# EAGLE design RTCRpi (EAGLE 7.3.0)
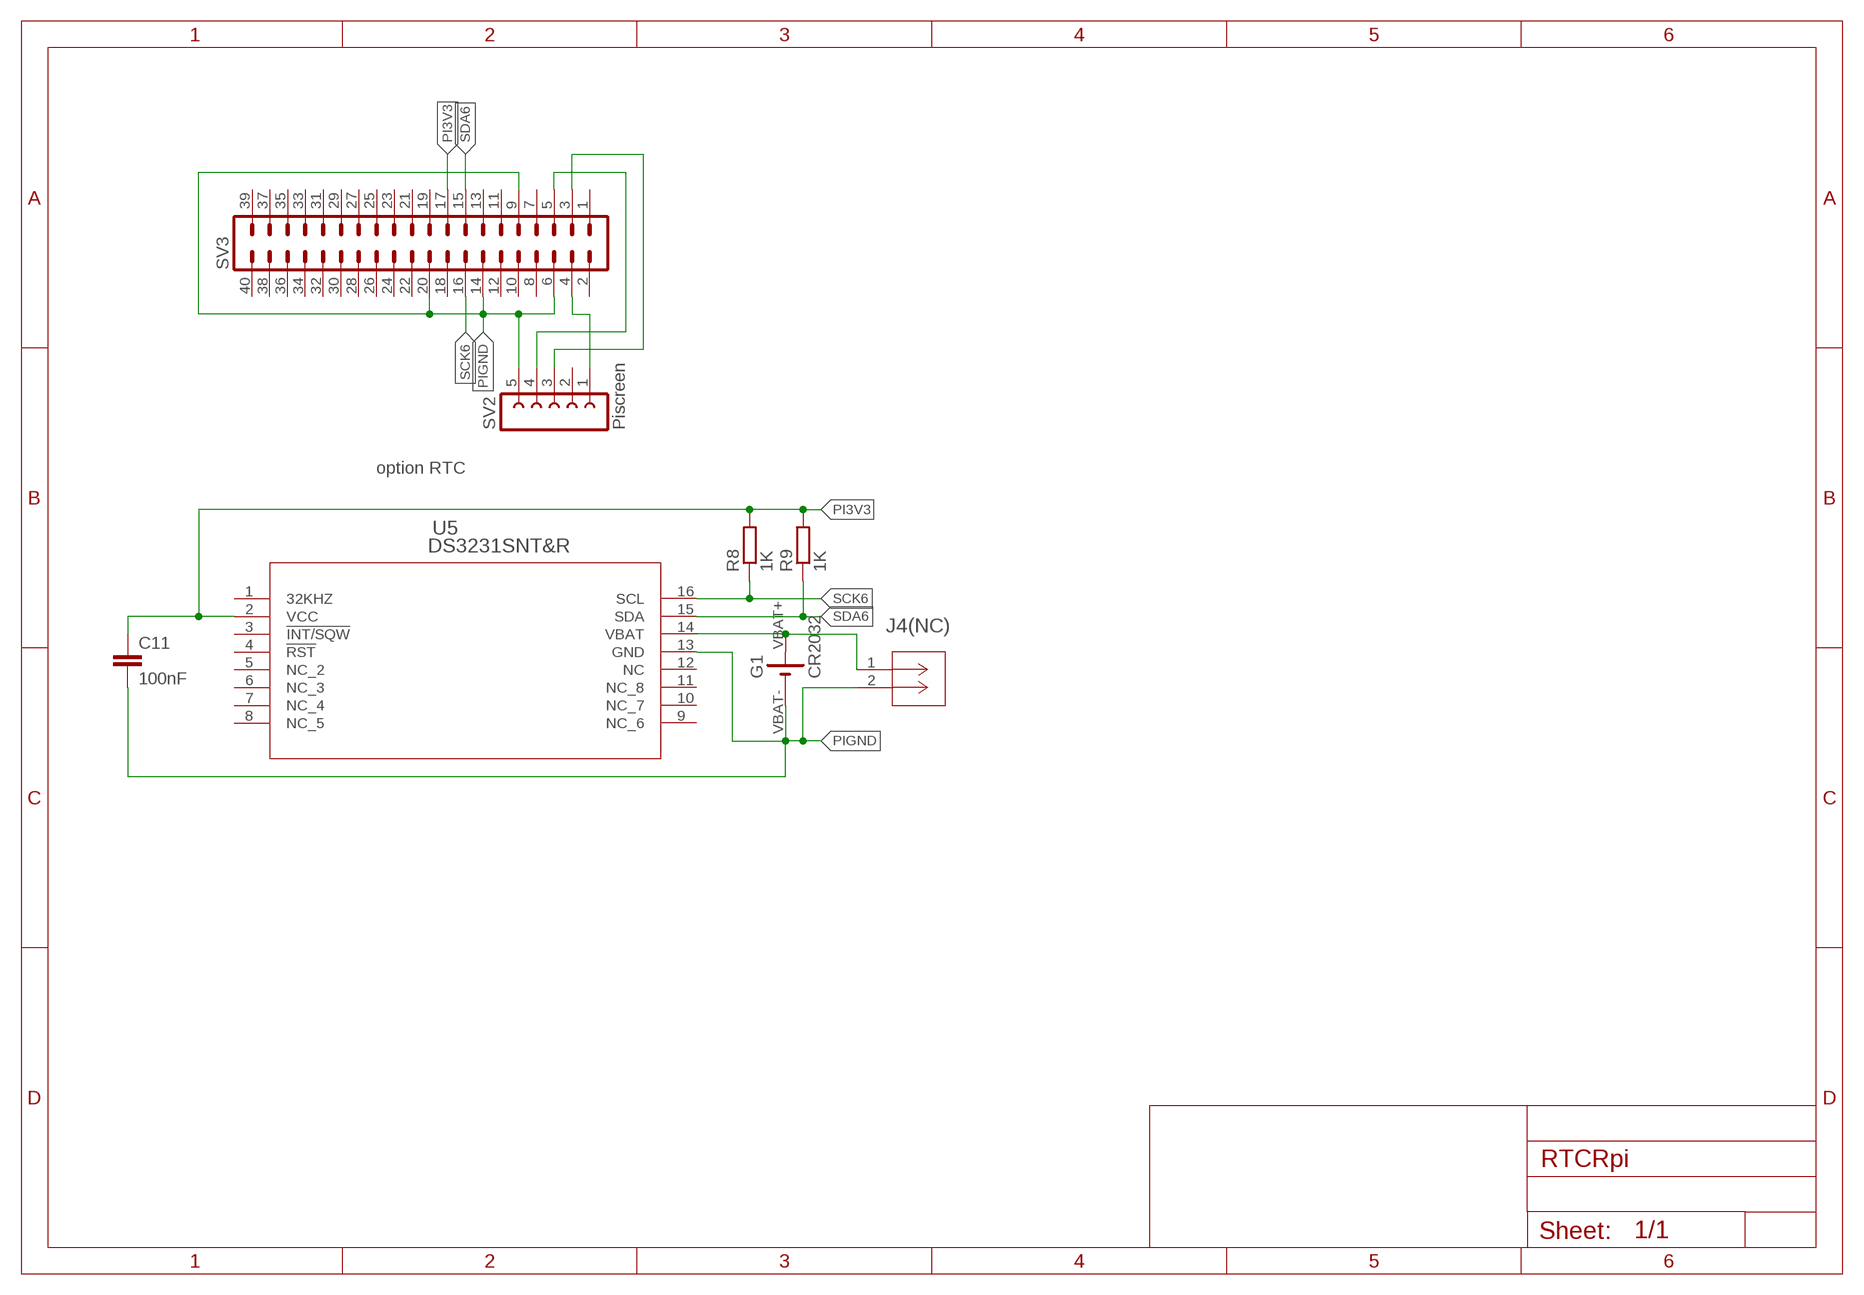
[diagram p0: schematic, sheet 1]

## Parts
C11  100nF  C-EUC0603K  [C0603K]
G1  CR2032  [CR2032]
J4(NC)  B2B-XH-A(LF)(SN)  [CONN_B2B-XH-A(LF)(SN)_JST]
R8  1K  R-EU_R0805  [R0805]
R9  1K  R-EU_R0805  [R0805]
SV2  Piscreen  FE05-1  [FE05-1]
SV3  MA20-2  [MA20-2]
U5  DS3231SNT&R  [21-0042B_16_MXM]

## Nets
N$11: SV2.1 SV3.4
N$14: SV2.4 SV3.5
N$15: SV2.3 SV3.3
PI3V3: C11.1 R8.2 R9.2 SV3.17 U5.2(VCC)
PIGND: C11.2 G1.VBAT-(-) J4(NC).2 SV2.5 SV3.6 SV3.9 SV3.14 SV3.20 U5.13(GND)
SCK6: R8.1 SV3.16 U5.16(SCL)
SDA6: R9.1 SV3.15 U5.15(SDA)
VBAT+: G1.VBAT+(+) J4(NC).1 U5.14(VBAT)
Unconnected: SV2.2 SV3.1 SV3.2 SV3.7 SV3.8 SV3.10 SV3.11 SV3.12 SV3.13 SV3.18 SV3.19 SV3.21 SV3.22 SV3.23 SV3.24 SV3.25 SV3.26 SV3.27 SV3.28 SV3.29 SV3.30 SV3.31 SV3.32 SV3.33 SV3.34 SV3.35 SV3.36 SV3.37 SV3.38 SV3.39 SV3.40 U5.1(32KHZ) U5.3(!INT/SQW) U5.4(!RST) U5.5(NC_2) U5.6(NC_3) U5.7(NC_4) U5.8(NC_5) U5.9(NC_6) U5.10(NC_7) U5.11(NC_8) U5.12(NC)

## Notes on the sheet
- option RTC

## Library data of the parts
C11 = rcl:C-EU: CAPACITOR, European symbol
G1 = PERSO2:CR2032: Battery Holder, SMT, 12mm multicomp PART NO. CH291-1220LF Source: Data sheet <http://www.farnell.com/datasheets/1505860.pdf>
J4(NC) = jstXH2pos:B2B-XH-A(LF)(SN); BUILT_BY: EMA_Cory; COPYRIGHT: Copyright (C) 2018 Accelerated Designs. All rights reserved; MANUFACTURER_PART_NUMBER: B2B-XH-A(LF)(SN); SOURCELIBRARY: JST_2019-12-02; VENDOR: JST
R8 R9 = rcl:R-EU_: RESISTOR, European symbol
SV2 = con-lsta:FE05-1: FEMALE HEADER; OC_FARNELL: unknown; OC_NEWARK: unknown
SV3 = con-lstb:MA20-2: PIN HEADER; OC_FARNELL: unknown; OC_NEWARK: unknown
U5 = DS3231SN:DS3231SNT&R; BUILT_BY: EMA_UL_Team; MANUFACTURER_PART_NUMBER: DS3231SN#T&R; SOURCELIBRARY: Maxim_2014-04-30_1; VENDOR: Maxim Integrated Products

## Net classes
0 default: clearance 0.305 mm

## Board
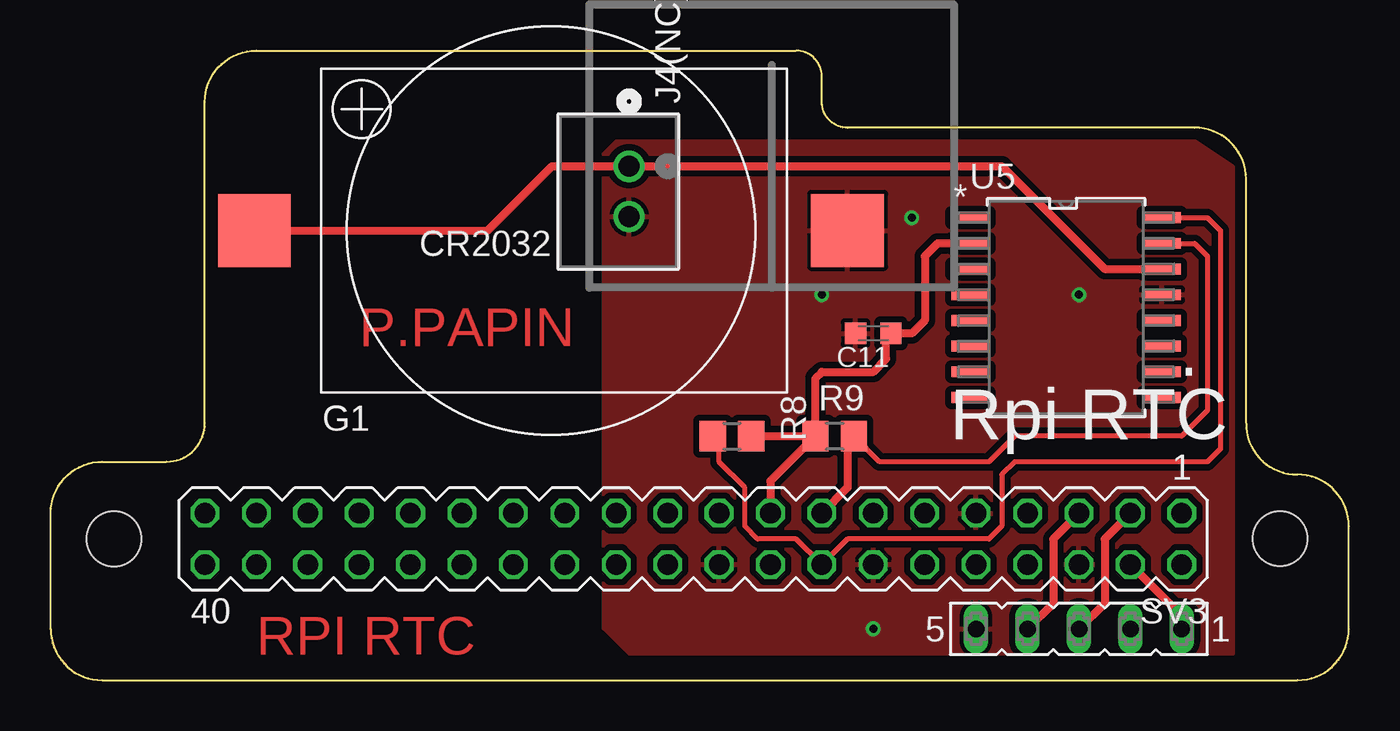
[diagram p1: board, top side]
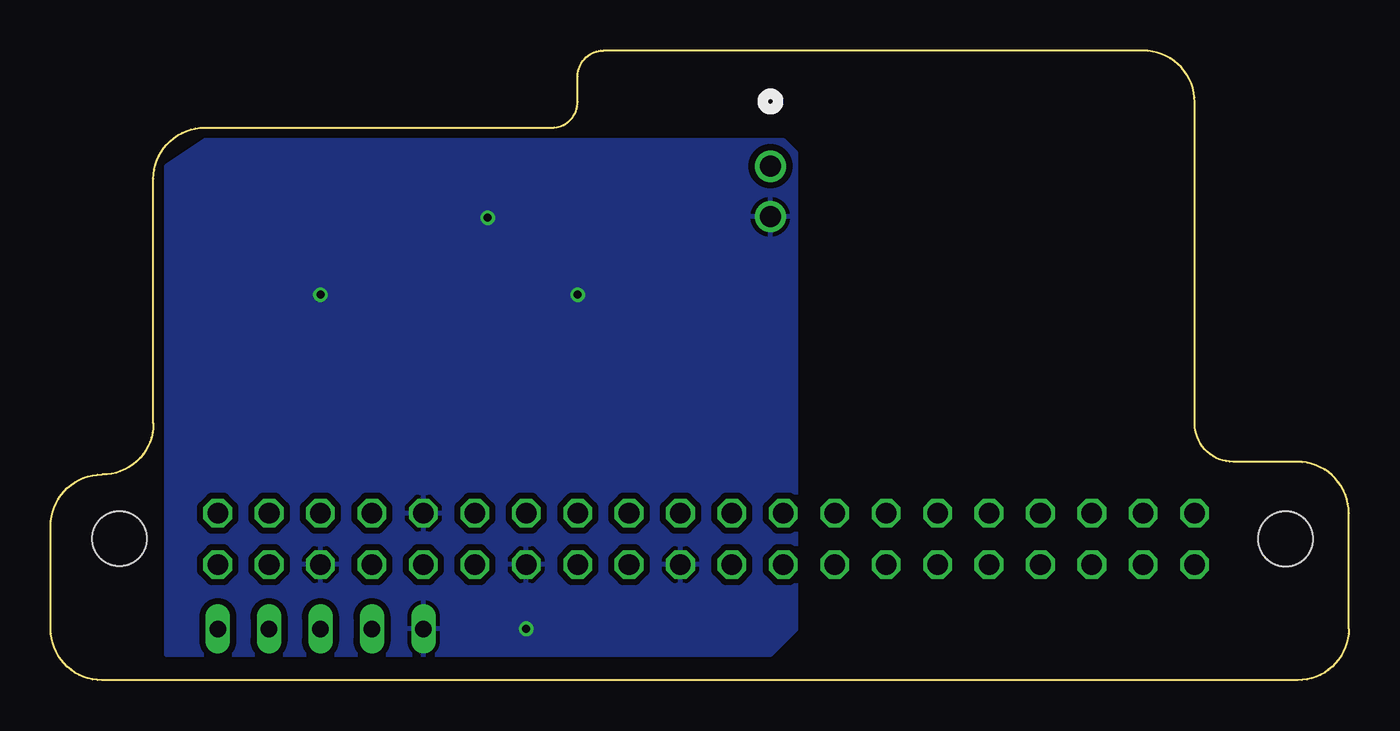
[diagram p2: board, bottom side, seen from below]

Size 64.14 x 31.11 mm. Coordinates in mm from the lower left corner, seen from the top.
Outline: 0,2.54 arc90 2.54,0 61.59,0 arc90 64.14,2.54 64.14,7.62 arc90 61.59,10.16 arc-90 59.05,12.7 59.05,24.76 arc90 56.52,27.3 39.37,27.3 arc-90 38.1,28.57 38.1,29.84 arc90 36.83,31.11 10.16,31.11 arc90 7.62,28.57 7.62,12.7 arc-90 5.71,10.79 2.54,10.79 arc90 0,8.25 0,2.54
Copper layers (1*16): Top 0.035mm / dielectric 1.5mm / Bottom 0.035mm
Design rules "PCB-POOL Standard": minimum track width 0.15mm, minimum drill 0.3mm, track to track 0.15mm, track to pad 0.15mm, pad to pad 0.15mm, via to via 0.15mm, smd to smd 0.15mm, copper to edge 0.3mm, drill to drill 0.2mm, minimum pad ring 0.2mm, minimum via ring 0.15mm, stop-mask expansion 0.03mm, vias tented up to drill 0mil, thermal gap 0.2mm
Holes 2.7 mm at 60.74,7 3.13,6.99

### Footprints (pad centres in the part's own frame; a part is rotated, then mirrored left to right if it is on the bottom)
C0603K = smd 1.05 x 1.08: 1 -0.875,0; 2 0.875,0
CR2032 = smd 3.6 x 3.6: VBAT+ 29.3,0; VBAT- 0,0
CONN_B2B-XH-A(LF)(SN)_JST = drill 1.041 pad 1.549: 1 0,0; 2 -2.489,0
R0805 = smd 1.3 x 1.5: 1 -0.95,0; 2 0.95,0
FE05-1 = drill 0.813 long: 1 -5.08,0; 2 -2.54,0; 3 0,0; 4 2.54,0; 5 5.08,0
MA20-2 = drill 1.016 octagon: 1 -24.13,-1.27; 2 -24.13,1.27; 3 -21.59,-1.27; 4 -21.59,1.27; 5 -19.05,-1.27; 6 -19.05,1.27; 7 -16.51,-1.27; 8 -16.51,1.27; 9 -13.97,-1.27; 10 -13.97,1.27; 11 -11.43,-1.27; 12 -11.43,1.27; 13 -8.89,-1.27; 14 -8.89,1.27; 15 -6.35,-1.27; 16 -6.35,1.27; 17 -3.81,-1.27; 18 -3.81,1.27; 19 -1.27,-1.27; 20 -1.27,1.27; 21 1.27,-1.27; 22 1.27,1.27; 23 3.81,-1.27; 24 3.81,1.27; 25 6.35,-1.27; 26 6.35,1.27; 27 8.89,-1.27; 28 8.89,1.27; 29 11.43,-1.27; 30 11.43,1.27; 31 13.97,-1.27; 32 13.97,1.27; 33 16.51,-1.27; 34 16.51,1.27; 35 19.05,-1.27; 36 19.05,1.27; 37 21.59,-1.27; 38 21.59,1.27; 39 24.13,-1.27; 40 24.13,1.27
21-0042B_16_MXM = smd 1.88 x 0.533: 1 -4.737,4.445; 2 -4.737,3.175; 3 -4.737,1.905; 4 -4.737,0.635; 5 -4.737,-0.635; 6 -4.737,-1.905; 7 -4.737,-3.175; 8 -4.737,-4.445; 9 4.737,-4.445; 10 4.737,-3.175; 11 4.737,-1.905; 12 4.737,-0.635; 13 4.737,0.635; 14 4.737,1.905; 15 4.737,3.175; 16 4.737,4.445

### Placement (x,y rotation side)
C11  40.64,17.14 180 top
G1  39.37,22.22 180 top
J4(NC)  28.57,25.4 90 top
R8  33.66,12.06 0 top
R9  38.73,12.06 180 top
SV2  50.8,2.54 180 top
SV3  31.75,6.98 180 top
U5  50.16,18.41 0 top

### Tracks (layer width: path | path; a pad name or v marks a point on that pad's centre or on a via)
N$11
  Top 0.406: SV2.1 55.88,3.17 SV3.4
N$14
  Top 0.406: SV2.4 49.53,3.81 49.53,6.98 SV3.5
N$15
  Top 0.406: SV2.3 52.07,3.81 52.07,6.98 SV3.3
PI3V3
  Top 0.406: R9.2 37.78,11.75 | R9.2 35.56,9.84 SV3.17 | R8.2 R9.2 | R9.2 37.78,14.92 38.1,15.24 40.64,15.24 41.27,15.87 41.27,16.91 C11.1 42.54,17.14 43.18,17.78 43.18,20.95 43.81,21.59 U5.2
PIGND  (via drill 0.4)
  other vias: 50.8,19.05 42.54,22.86 38.1,19.05 40.64,2.54
  pour Bottom: 27.3,26.04 27.94,26.67 56.52,26.67 58.42,25.4 58.42,1.27 28.57,1.27 27.3,2.54
  pour Top: 27.3,10.79 27.3,26.04 27.94,26.67 56.52,26.67 58.42,25.4 58.42,1.27 28.57,1.27 27.3,2.54 27.3,5.08
SCK6
  Top 0.254: U5.16 57.15,22.86 57.78,22.22 57.78,11.43 57.15,10.79 47.62,10.79 46.99,10.16 46.99,7.62 46.35,6.98 39.37,6.98 SV3.16 36.83,6.98 34.92,6.98 34.29,7.62 34.29,9.52 33.02,10.79 33.02,11.75 R8.1
SDA6
  Top 0.254: U5.15 56.52,21.59 57.15,20.95 57.15,13.33 55.88,12.06 47.62,12.06 46.35,10.79 40.95,10.79 R9.1 | 40,12.06 39.37,11.43
  Top 0.406: R9.1 39.37,11.75 39.37,11.43 39.37,9.52 SV3.15
VBAT+
  Top 0.406: G1.VBAT+ 21.59,22.22 24.77,25.4 J4(NC).1 46.99,25.4 52.07,20.32 U5.14

### Text on the board
Top: P.PAPIN | RPI RTC
tNames: Rpi RTC